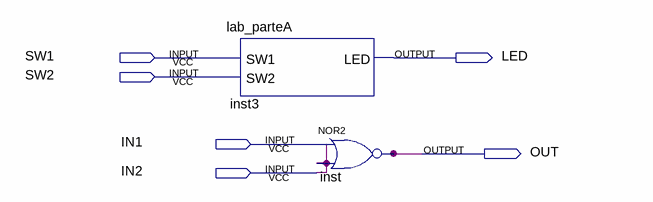
[diagram p0: schematic sheet]
// Quartus schematic Block2.bdf as structural Verilog: 2 symbols, 6 pins
module Block2 (
  input  SW1,
  input  SW2,
  input  IN1,
  input  IN2,
  output LED,
  output OUT
);

  lab_parteA inst3 (.SW1(SW1), .SW2(SW2), .LED(LED));
  nor inst (OUT, IN1, IN1);

  assign IN2 = IN1;
endmodule
